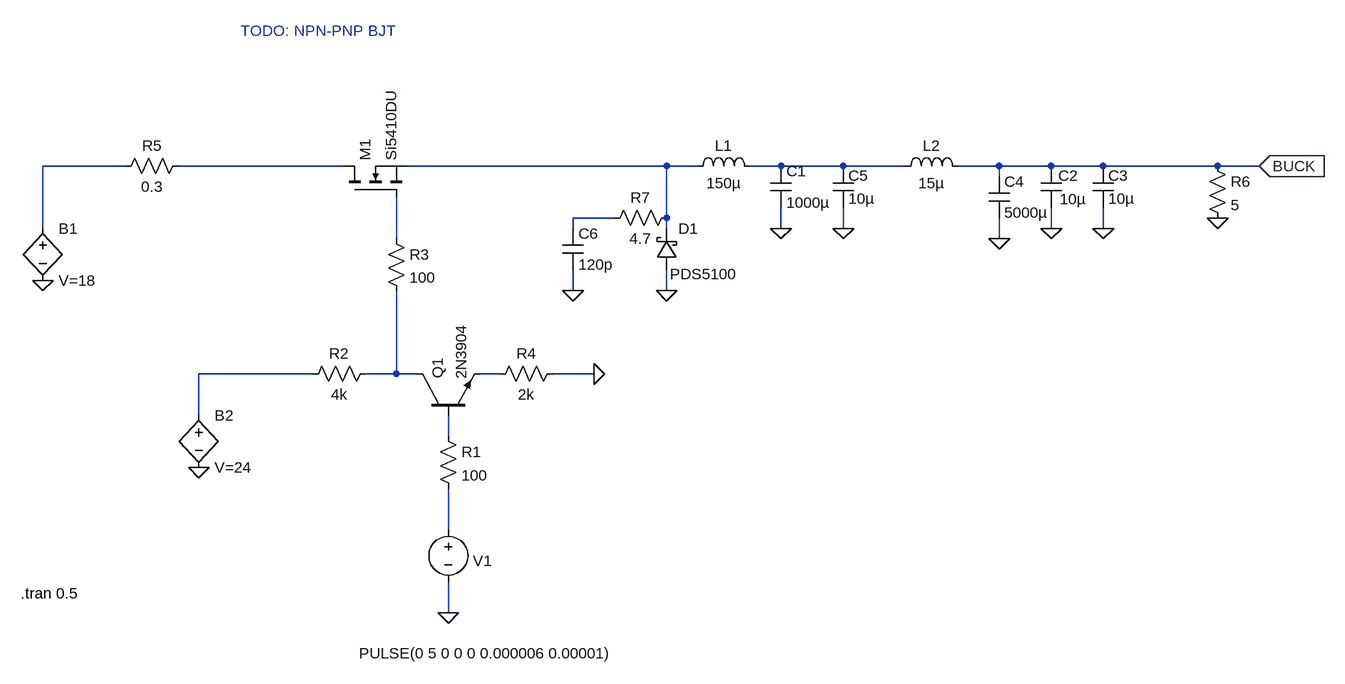
[diagram p0: schematic Draft1.asc]
Draft1.asc, the LTspice schematic file:
Version 4
SHEET 1 880 680
WIRE -54592 -2864 -54720 -2864
WIRE -54256 -2864 -54512 -2864
WIRE -53760 -2864 -54160 -2864
WIRE -53712 -2864 -53760 -2864
WIRE -53584 -2864 -53632 -2864
WIRE -53488 -2864 -53584 -2864
WIRE -53392 -2864 -53488 -2864
WIRE -53248 -2864 -53312 -2864
WIRE -53168 -2864 -53248 -2864
WIRE -53088 -2864 -53168 -2864
WIRE -52912 -2864 -53088 -2864
WIRE -52848 -2864 -52912 -2864
WIRE -53248 -2848 -53248 -2864
WIRE -53840 -2784 -53904 -2784
WIRE -53760 -2784 -53760 -2864
WIRE -54720 -2768 -54720 -2864
WIRE -53904 -2768 -53904 -2784
WIRE -53760 -2768 -53760 -2784
WIRE -53584 -2768 -53584 -2800
WIRE -53488 -2768 -53488 -2800
WIRE -53168 -2768 -53168 -2800
WIRE -53088 -2768 -53088 -2800
WIRE -54176 -2752 -54176 -2816
WIRE -53248 -2752 -53248 -2784
WIRE -53904 -2672 -53904 -2704
WIRE -53760 -2672 -53760 -2704
WIRE -54304 -2544 -54480 -2544
WIRE -54176 -2544 -54176 -2672
WIRE -54176 -2544 -54224 -2544
WIRE -54144 -2544 -54176 -2544
WIRE -54016 -2544 -54048 -2544
WIRE -53872 -2544 -53936 -2544
WIRE -54480 -2480 -54480 -2544
WIRE -54096 -2448 -54096 -2480
WIRE -54096 -2304 -54096 -2368
WIRE -54096 -2176 -54096 -2224
FLAG -54096 -2176 0
FLAG -53584 -2768 0
FLAG -53168 -2768 0
FLAG -53088 -2768 0
FLAG -52848 -2864 BUCK
IOPIN -52848 -2864 In
FLAG -53248 -2752 0
FLAG -53872 -2544 0
FLAG -53760 -2672 0
FLAG -53488 -2768 0
FLAG -54480 -2400 0
FLAG -54720 -2688 0
FLAG -52912 -2784 0
FLAG -53904 -2672 0
SYMBOL voltage -54096 -2320 R0
WINDOW 3 -137 206 Left 2
WINDOW 123 39 113 Left 2
WINDOW 39 0 0 Left 2
WINDOW 0 38 64 Left 2
SYMATTR Value PULSE(0 5 0 0 0 0.000006 0.00001)
SYMATTR InstName V1
SYMBOL ind -53728 -2848 R270
WINDOW 0 32 56 VTop 2
WINDOW 3 5 56 VBottom 2
SYMATTR InstName L1
SYMATTR Value 150µ
SYMATTR SpiceLine Rser=0.11
SYMBOL cap -53600 -2864 R0
SYMATTR InstName C1
SYMATTR Value 1000µ
SYMATTR SpiceLine Rser=0.04
SYMBOL cap -53184 -2864 R0
WINDOW 0 27 15 Left 2
WINDOW 3 29 51 Left 2
SYMATTR InstName C2
SYMATTR Value 10µ
SYMATTR SpiceLine Rser=0.004
SYMBOL cap -53104 -2864 R0
WINDOW 0 24 15 Left 2
WINDOW 3 24 50 Left 2
SYMATTR InstName C3
SYMATTR Value 10µ
SYMATTR SpiceLine Rser=0.004
SYMBOL ind -53408 -2848 R270
WINDOW 0 32 56 VTop 2
WINDOW 3 5 56 VBottom 2
SYMATTR InstName L2
SYMATTR Value 15µ
SYMATTR SpiceLine Rser=0.05
SYMBOL cap -53264 -2848 R0
SYMATTR InstName C4
SYMATTR Value 5000µ
SYMBOL npn -54144 -2480 R270
SYMATTR InstName Q1
SYMATTR Value 2N3904
SYMBOL res -54112 -2464 R0
SYMATTR InstName R1
SYMATTR Value 100
SYMBOL res -54320 -2528 R270
WINDOW 0 32 56 VTop 2
WINDOW 3 0 56 VBottom 2
SYMATTR InstName R2
SYMATTR Value 4k
SYMBOL res -54192 -2768 R0
SYMATTR InstName R3
SYMATTR Value 100
SYMBOL nmos -54256 -2816 R270
SYMATTR InstName M1
SYMATTR Value Si5410DU
SYMBOL schottky -53744 -2704 R180
WINDOW 0 -33 64 Left 2
WINDOW 3 -92 -6 Left 2
SYMATTR InstName D1
SYMATTR Value PDS5100
SYMATTR Description Diode
SYMATTR Type diode
SYMBOL res -53920 -2560 R90
WINDOW 0 0 56 VBottom 2
WINDOW 3 32 56 VTop 2
SYMATTR InstName R4
SYMATTR Value 2k
SYMBOL cap -53504 -2864 R0
WINDOW 0 24 15 Left 2
WINDOW 3 24 50 Left 2
SYMATTR InstName C5
SYMATTR Value 10µ
SYMATTR SpiceLine Rser=0.004
SYMBOL bv -54720 -2784 R0
SYMATTR InstName B1
SYMATTR Value V=18
SYMBOL bv -54480 -2496 R0
SYMATTR InstName B2
SYMATTR Value V=24
SYMBOL res -54496 -2880 R90
WINDOW 0 0 56 VBottom 2
WINDOW 3 32 56 VTop 2
SYMATTR InstName R5
SYMATTR Value 0.3
SYMBOL res -52928 -2880 R0
SYMATTR InstName R6
SYMATTR Value 5
SYMBOL cap -53920 -2768 R0
SYMATTR InstName C6
SYMATTR Value 120p
SYMBOL res -53744 -2800 R90
WINDOW 0 0 56 VBottom 2
WINDOW 3 32 56 VTop 2
SYMATTR InstName R7
SYMATTR Value 4.7
TEXT -54416 -3072 Left 2 ;TODO: NPN-PNP BJT
TEXT -54754 -2206 Left 2 !.tran 0.5

The netlist it stands for:
* Draft1.asc
V1 N011 0 PULSE(0 5 0 0 0 0.000006 0.00001)
L1 N003 N004 150µ Rser=0.11
C1 N004 0 1000µ Rser=0.04
C2 BUCK 0 10µ Rser=0.004
C3 BUCK 0 10µ Rser=0.004
L2 N004 BUCK 15µ Rser=0.05
C4 BUCK 0 5000µ
Q1 N008 N010 N009 0 2N3904
R1 N010 N011 100
R2 N007 N008 4k
R3 N006 N008 100
M1 N002 N006 N003 N003 Si5410DU
D1 0 N003 PDS5100
R4 0 N009 2k
C5 N004 0 10µ Rser=0.004
B1 N001 0 V=18
B2 N007 0 V=24
R5 N002 N001 0.3
R6 BUCK 0 5
C6 N005 0 120p
R7 N003 N005 4.7
.model D D
.lib standard.dio
.model NPN NPN
.model PNP PNP
.lib standard.bjt
.model NMOS NMOS
.model PMOS PMOS
.lib standard.mos
* TODO: NPN-PNP BJT
.tran 0.5
.backanno
.end